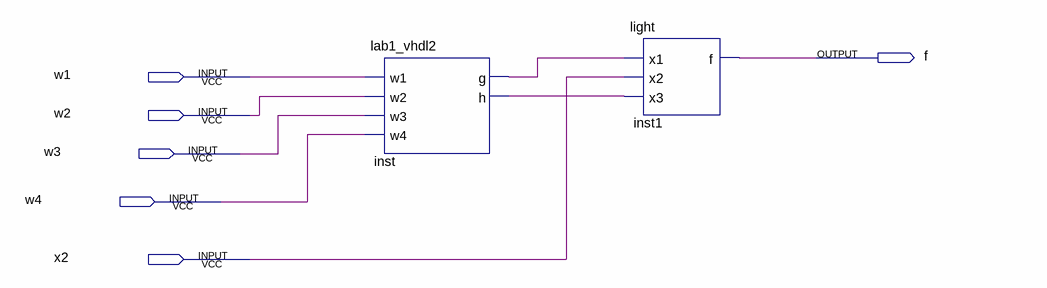
[diagram p0: schematic sheet]
// Quartus schematic mixed.bdf as structural Verilog: 2 symbols, 6 pins
module mixed (
  input  w1,
  input  w2,
  input  w3,
  input  w4,
  input  x2,
  output f
);

  wire inst_g, inst_h;

  lab1_vhdl2 inst (.w1(w1), .w2(w2), .w3(w3), .w4(w4), .g(inst_g), .h(inst_h));
  light inst1 (.x1(inst_g), .x2(x2), .x3(inst_h), .f(f));
endmodule
